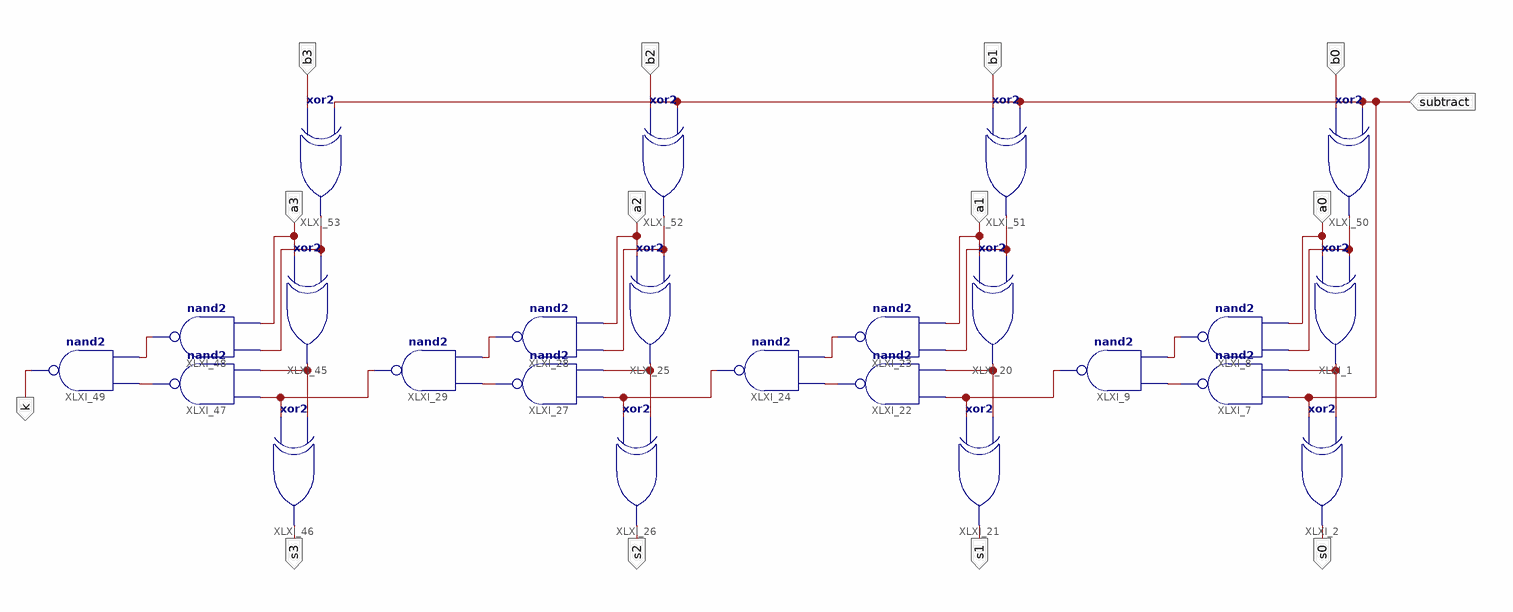
[diagram p0: schematic sheet 1]
// Xilinx ISE schematic lab7rippleaddsub.sch (xa9500xl) as structural Verilog: 24 symbols, 14 ports
module lab7rippleaddsub (
  input  subtract,
  input  a0,
  input  b0,
  input  a1,
  input  a2,
  input  a3,
  input  b1,
  input  b2,
  input  b3,
  output k,
  output s0,
  output s1,
  output s2,
  output s3
);

  wire XLXN_29, XLXN_30, XLXN_56, XLXN_89, XLXN_90, XLXN_91, XLXN_93, XLXN_97, XLXN_98, XLXN_99, XLXN_101,
       XLXN_129, XLXN_130, XLXN_131, XLXN_133, XLXN_173, XLXN_174, XLXN_179, XLXN_180;

  xor XLXI_1 (XLXN_56, a0, XLXN_173);
  xor XLXI_2 (s0, subtract, XLXN_56);
  nand XLXI_7 (XLXN_30, XLXN_56, subtract);
  nand XLXI_8 (XLXN_29, a0, XLXN_173);
  nand XLXI_9 (XLXN_90, XLXN_29, XLXN_30);
  xor XLXI_20 (XLXN_89, a1, XLXN_174);
  xor XLXI_21 (s1, XLXN_90, XLXN_89);
  nand XLXI_22 (XLXN_91, XLXN_89, XLXN_90);
  nand XLXI_23 (XLXN_93, a1, XLXN_174);
  nand XLXI_24 (XLXN_98, XLXN_93, XLXN_91);
  xor XLXI_25 (XLXN_97, a2, XLXN_179);
  xor XLXI_26 (s2, XLXN_98, XLXN_97);
  nand XLXI_27 (XLXN_99, XLXN_97, XLXN_98);
  nand XLXI_28 (XLXN_101, a2, XLXN_179);
  nand XLXI_29 (XLXN_130, XLXN_101, XLXN_99);
  xor XLXI_45 (XLXN_129, a3, XLXN_180);
  xor XLXI_46 (s3, XLXN_130, XLXN_129);
  nand XLXI_47 (XLXN_131, XLXN_129, XLXN_130);
  nand XLXI_48 (XLXN_133, a3, XLXN_180);
  nand XLXI_49 (k, XLXN_133, XLXN_131);
  xor XLXI_50 (XLXN_173, b0, subtract);
  xor XLXI_51 (XLXN_174, b1, subtract);
  xor XLXI_52 (XLXN_179, b2, subtract);
  xor XLXI_53 (XLXN_180, b3, subtract);
endmodule
